# Altium schematic sheet 03-multimodal-battery-charger.SchDoc
size A4; SheetNumber: 4; SheetTotal: 13
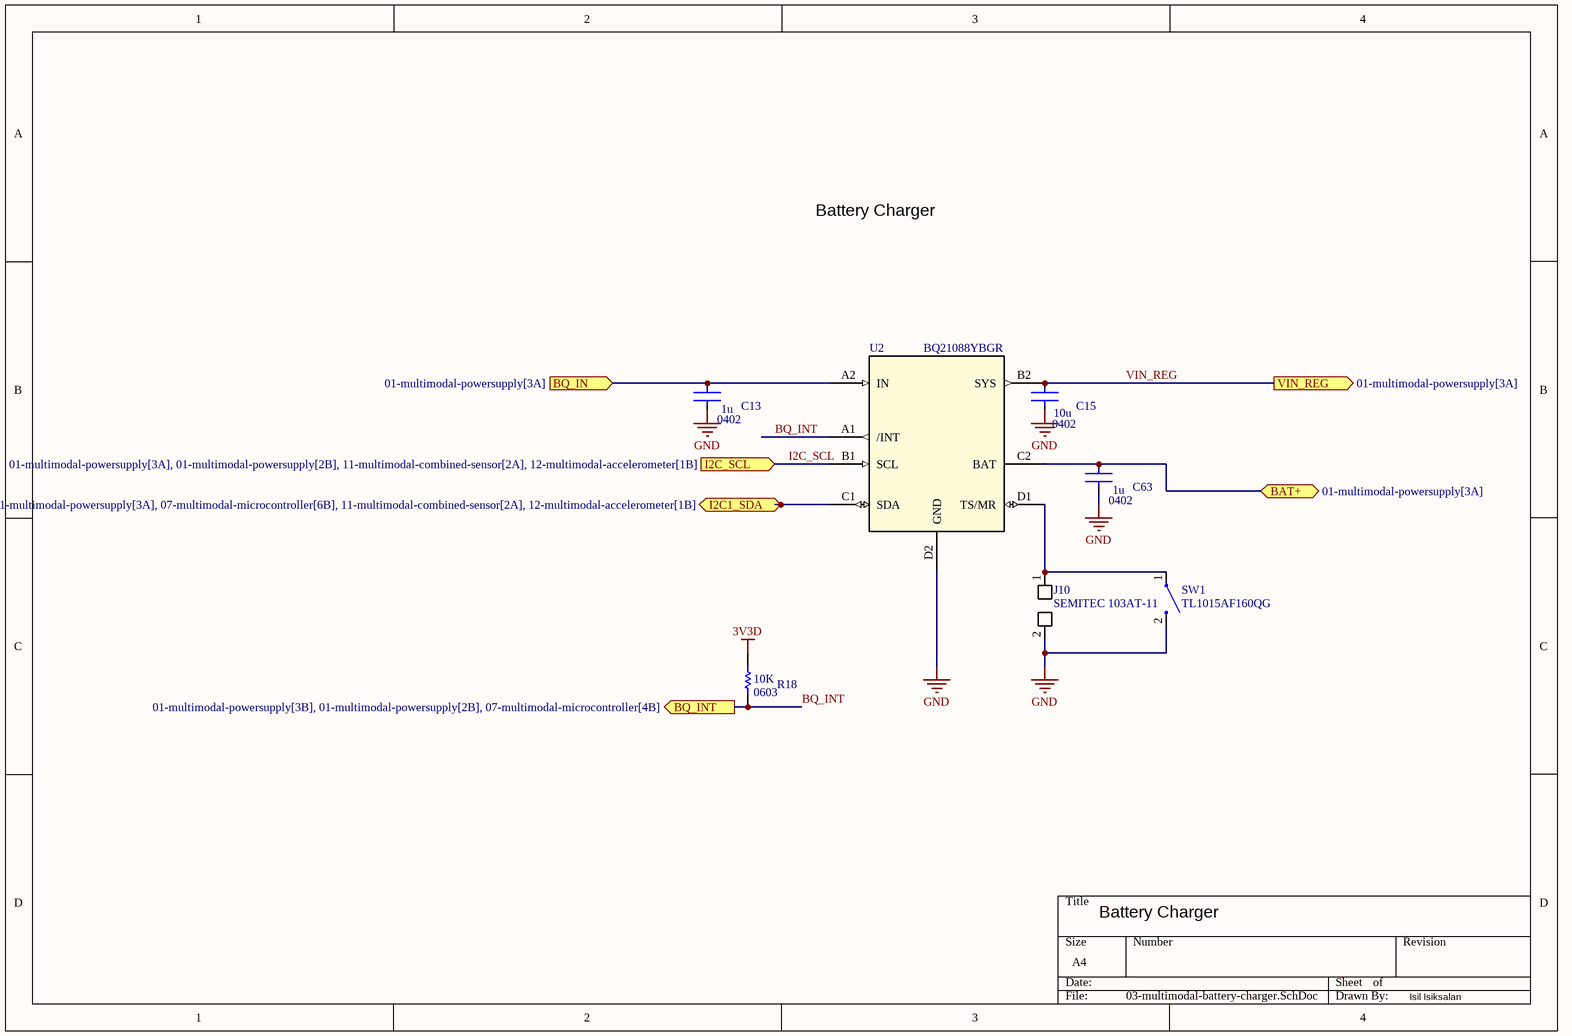
[diagram p0: 03-multimodal-battery-charger.SchDoc]

## Parts
C13  C1005X5R1V105K050BC  [CAPTDK0402]  (value not drawn)
C15  GRM155R61A106ME11D  [CAPTDK0402]  (value not drawn)
C63  C1005X5R1V105K050BC  [CAPTDK0402]  (value not drawn)
J10  SEMITEC 103AT-11  [NTC_connection]
R18  RMCF0603JG10K0  [RES-STACK-POLE-0603]  (value not drawn)
SW1  TL1015AF160QG  [TACTILE-SWITCH]
U2  BQ21088YBGR  [YBG0008_TEX]

## Ports
BAT+ (bidir, see 01-multimodal-powersupply[3A]), BQ_IN (in, see 01-multimodal-powersupply[3A]), BQ_INT (out, see 01-multimodal-powersupply[3B], 01-multimodal-powersupply[2B], 07-multimodal-microcontroller[4B]), I2C1_SDA (bidir, see 01-multimodal-powersupply[3A], 07-multimodal-microcontroller[6B], 11-multimodal-combined-sensor[2A], 12-multimodal-accelerometer[1B]), I2C_SCL (in, see 01-multimodal-powersupply[3A], 01-multimodal-powersupply[2B], 11-multimodal-combined-sensor[2A], 12-multimodal-accelerometer[1B]), VIN_REG (out, see 01-multimodal-powersupply[3A])

## Nets
3V3D: R18.2
GND: C13.2 C15.2 C63.2 J10.2 SW1.2 U2.D2(GND)
BAT+: C63.1 U2.C2(BAT) ; port BAT+
BQ_IN: C13.1 U2.A2(IN) ; port BQ_IN
BQ_INT: R18.1 U2.A1(/INT) ; port BQ_INT
I2C1_SDA: U2.C1(SDA) ; port I2C1_SDA
I2C_SCL: U2.B1(SCL) ; port I2C_SCL
VIN_REG: C15.1 U2.B2(SYS) ; port VIN_REG
NetJ10_1: J10.1 SW1.1 U2.D1(TS/MR)

## Notes on the sheet
- Battery Charger
- Isil Isiksalan
- (in symbol C1005X5R1V105K050BC) 1u; 0402
- (in symbol GRM155R61A106ME11D) 10u; 0402
- (in symbol RMCF0603JG10K0) 10K; 0603

## Library data of the parts
C13 C63 = C1005X5R1V105K050BC: CAP CER 1UF 35V X5R 0402; Supplier 1: Digi-Key; Supplier Part Number 1: 445-9073-1-ND
C15 = GRM155R61A106ME11D: CAP CER 10UF 10V X5R 0402; Supplier 1: Digi-Key; Supplier Part Number 1: 490-GRM155R61A106ME11DCT-ND
J10 = SEMITEC 103AT-11: NTC THERMISTOR 10KOHM 1%
R18 = RMCF0603JG10K0: RES 10K OHM 5% 1/10W 0603; Supplier 1: Digi-Key; Supplier Part Number 1: 738-RMCF0603JG10K0CT-ND
SW1 = TL1015AF160QG: SWITCH TACTILE SPST-NO 0.05A 12V; Supplier 1: Digi-Key; Supplier Part Number 1: EG4344CT-ND
U2 = BQ21088YBGR: I2C, 1A single cell linear battery charger, 5V input, powerpath, ship mode and battery tracking 8-DSBGA -40 to 85; Manufacturer_Name: Texas Instruments; Copyright: Copyright (C) 2026 Ultra Librarian. All rights reserved.; Manufacturer_Part_Number: BQ21088YBGR; Datasheet: https://www.ti.com/lit/gpn/bq21088; RefDes: RefDes; Type: Type